# Altium project robotcar.PrjPcb
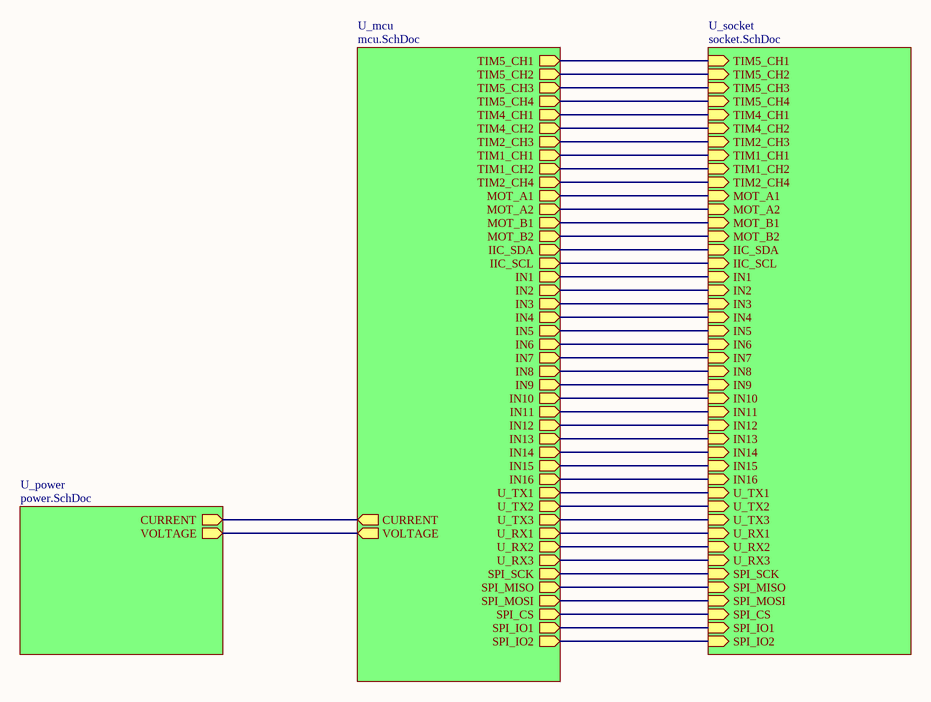
[diagram p0: robotcar.SchDoc]
4 sheets, 123 parts. Net scope: hierarchical (ports join the sheet entries above them; power ports are global).
Board file: robotcar.PcbDoc
Sheets:
  robotcar.SchDoc
    U_socket = socket.SchDoc
    U_mcu = mcu.SchDoc
    U_power = power.SchDoc

## Sheet robotcar.SchDoc
size A3

### Sub-sheets
U_mcu = mcu.SchDoc: TIM5_CH1 (out), TIM5_CH2 (out), TIM5_CH3 (out), TIM5_CH4 (out), TIM4_CH1 (out), TIM4_CH2 (out), TIM2_CH3 (out), TIM1_CH1 (out), TIM1_CH2 (out), TIM2_CH4 (out), MOT_A1 (out), MOT_A2 (out), MOT_B1 (out), MOT_B2 (out), IIC_SDA (out), IIC_SCL (out), IN1 (out), IN2 (out), IN3 (out), IN4 (out), IN5 (out), IN6 (out), IN7 (out), IN8 (out), IN9 (out), IN10 (out), IN11 (out), IN12 (out), IN13 (out), IN14 (out), IN15 (out), IN16 (out), U_TX1 (out), U_TX2 (out), U_TX3 (out), U_RX1 (out), U_RX2 (out), U_RX3 (out), CURRENT (out), VOLTAGE (out), SPI_SCK (out), SPI_MISO (out), SPI_MOSI (out), SPI_CS (out), SPI_IO1 (out), SPI_IO2 (out)
U_power = power.SchDoc: CURRENT (out), VOLTAGE (out)
U_socket = socket.SchDoc: TIM5_CH1 (in), TIM5_CH2 (in), TIM5_CH3 (in), TIM5_CH4 (in), TIM4_CH1 (in), TIM4_CH2 (in), TIM2_CH3 (in), TIM1_CH1 (in), TIM1_CH2 (in), TIM2_CH4 (in), MOT_A1 (in), MOT_A2 (in), MOT_B1 (in), MOT_B2 (in), IIC_SDA (in), IIC_SCL (in), IN1 (in), IN2 (in), IN3 (in), IN4 (in), IN5 (in), IN6 (in), IN7 (in), IN8 (in), IN9 (in), IN10 (in), IN11 (in), IN12 (in), IN13 (in), IN14 (in), IN15 (in), IN16 (in), U_TX1 (in), U_TX2 (in), U_TX3 (in), U_RX1 (in), U_RX2 (in), U_RX3 (in), SPI_SCK (in), SPI_MISO (in), SPI_MOSI (in), SPI_CS (in), SPI_IO1 (in), SPI_IO2 (in)

### Nets
MPU_SCL: sheet U_socket/IIC_SCL, sheet U_mcu/IIC_SCL
MPU_SDA: sheet U_socket/IIC_SDA, sheet U_mcu/IIC_SDA
PA0: sheet U_socket/TIM5_CH1, sheet U_mcu/TIM5_CH1
PA1: sheet U_socket/TIM5_CH2, sheet U_mcu/TIM5_CH2
PA2: sheet U_socket/TIM5_CH3, sheet U_mcu/TIM5_CH3
PA3: sheet U_socket/TIM5_CH4, sheet U_mcu/TIM5_CH4
PA4: sheet U_socket/SPI_CS, sheet U_mcu/SPI_CS
PA5: sheet U_socket/SPI_SCK, sheet U_mcu/SPI_SCK
PA6: sheet U_socket/SPI_MISO, sheet U_mcu/SPI_MISO
PA7: sheet U_socket/SPI_MOSI, sheet U_mcu/SPI_MOSI
PA8: sheet U_socket/IN16, sheet U_mcu/IN16
PA9: sheet U_socket/U_TX1, sheet U_mcu/U_TX1
PA10: sheet U_socket/U_RX1, sheet U_mcu/U_RX1
PA15: sheet U_socket/IN15, sheet U_mcu/IN15
PB0: sheet U_mcu/CURRENT, sheet U_power/CURRENT
PB1: sheet U_mcu/VOLTAGE, sheet U_power/VOLTAGE
PB8: sheet U_socket/IN7, sheet U_mcu/IN7
PB9: sheet U_socket/IN8, sheet U_mcu/IN8
PB10: sheet U_socket/TIM2_CH3, sheet U_mcu/TIM2_CH3
PB11: sheet U_socket/TIM2_CH4, sheet U_mcu/TIM2_CH4
PC0: sheet U_socket/IN1, sheet U_mcu/IN1
PC1: sheet U_socket/IN2, sheet U_mcu/IN2
PC2: sheet U_socket/IN3, sheet U_mcu/IN3
PC3: sheet U_socket/IN4, sheet U_mcu/IN4
PC4: sheet U_socket/IN5, sheet U_mcu/IN5
PC5: sheet U_socket/IN6, sheet U_mcu/IN6
PC6: sheet U_socket/SPI_IO1, sheet U_mcu/SPI_IO1
PC7: sheet U_socket/SPI_IO2, sheet U_mcu/SPI_IO2
PD0: sheet U_socket/IN14, sheet U_mcu/IN14
PD5: sheet U_socket/U_TX2, sheet U_mcu/U_TX2
PD6: sheet U_socket/U_RX2, sheet U_mcu/U_RX2
PD8: sheet U_socket/U_TX3, sheet U_mcu/U_TX3
PD9: sheet U_socket/U_RX3, sheet U_mcu/U_RX3
PD10: sheet U_socket/IN10, sheet U_mcu/IN10
PD11: sheet U_socket/IN11, sheet U_mcu/IN11
PD12: sheet U_socket/TIM4_CH1, sheet U_mcu/TIM4_CH1
PD13: sheet U_socket/TIM4_CH2, sheet U_mcu/TIM4_CH2
PD14: sheet U_socket/IN12, sheet U_mcu/IN12
PD15: sheet U_socket/IN13, sheet U_mcu/IN13
PE9: sheet U_socket/TIM1_CH1, sheet U_mcu/TIM1_CH1
PE10: sheet U_socket/MOT_A1, sheet U_mcu/MOT_A1
PE11: sheet U_socket/TIM1_CH2, sheet U_mcu/TIM1_CH2
PE12: sheet U_socket/MOT_A2, sheet U_mcu/MOT_A2
PE13: sheet U_socket/MOT_B1, sheet U_mcu/MOT_B1
PE14: sheet U_socket/MOT_B2, sheet U_mcu/MOT_B2
PE15: sheet U_socket/IN9, sheet U_mcu/IN9

## Sheet socket.SchDoc
size A4
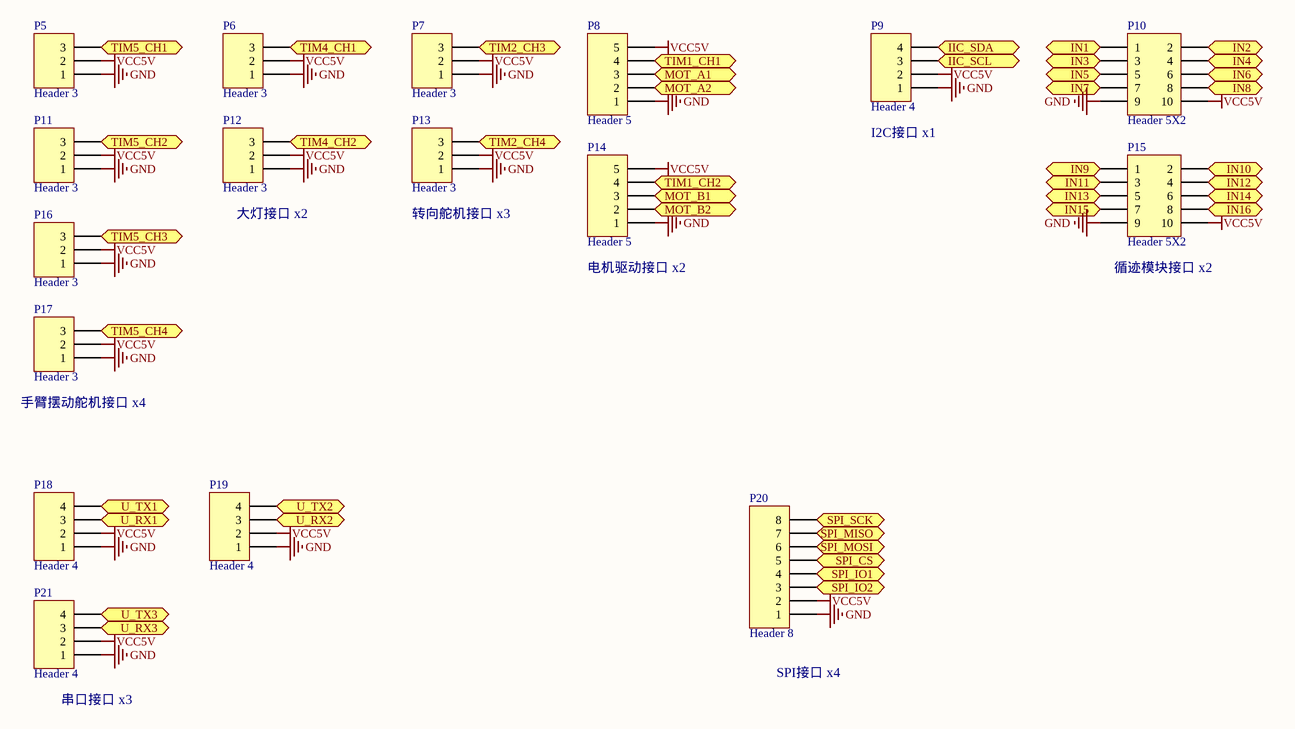
[diagram p1: socket.SchDoc]

### Parts
P5  Header 3  [HDR1X3]
P6  Header 3  [HDR1X3]
P7  Header 3  [HDR1X3]
P8  Header 5  [HDR1X5]
P9  Header 4  [HDR1X4]
P10  Header 5X2  [HDR2X5]
P11  Header 3  [HDR1X3]
P12  Header 3  [HDR1X3]
P13  Header 3  [HDR1X3]
P14  Header 5  [HDR1X5]
P15  Header 5X2  [HDR2X5]
P16  Header 3  [HDR1X3]
P17  Header 3  [HDR1X3]
P18  Header 4  [HDR1X4]
P19  Header 4  [HDR1X4]
P20  Header 8  [HDR1X8]
P21  Header 4  [HDR1X4]

### Ports
IIC_SCL (in), IIC_SDA (in), IN1 (in), IN2 (in), IN3 (in), IN4 (in), IN5 (in), IN6 (in), IN7 (in), IN8 (in), IN9 (in), IN10 (in), IN11 (in), IN12 (in), IN13 (in), IN14 (in), IN15 (in), IN16 (in), MOT_A1 (in), MOT_A2 (in), MOT_B1 (in), MOT_B2 (in), SPI_CS (in), SPI_IO1 (in), SPI_IO2 (in), SPI_MISO (in), SPI_MOSI (in), SPI_SCK (in), TIM1_CH1 (in), TIM1_CH2 (in), TIM2_CH3 (in), TIM2_CH4 (in), TIM4_CH1 (in), TIM4_CH2 (in), TIM5_CH1 (in), TIM5_CH2 (in), TIM5_CH3 (in), TIM5_CH4 (in), U_RX1 (in), U_RX2 (in), U_RX3 (in), U_TX1 (in), U_TX2 (in), U_TX3 (in)

### Nets
GND: P5.1 P6.1 P7.1 P8.1 P9.1 P10.9 P11.1 P12.1 P13.1 P14.1 P15.9 P16.1 P17.1 P18.1 P19.1 P20.1 P21.1
VCC5V: P5.2 P6.2 P7.2 P8.5 P9.2 P10.10 P11.2 P12.2 P13.2 P14.5 P15.10 P16.2 P17.2 P18.2 P19.2 P20.2 P21.2
MPU_SCL: P9.3 ; port IIC_SCL
MPU_SDA: P9.4 ; port IIC_SDA
PA0: P5.3 ; port TIM5_CH1
PA1: P11.3 ; port TIM5_CH2
PA2: P16.3 ; port TIM5_CH3
PA3: P17.3 ; port TIM5_CH4
PA4: P20.5 ; port SPI_CS
PA5: P20.8 ; port SPI_SCK
PA6: P20.7 ; port SPI_MISO
PA7: P20.6 ; port SPI_MOSI
PA8: P15.8 ; port IN16
PA9: P18.4 ; port U_TX1
PA10: P18.3 ; port U_RX1
PA15: P15.7 ; port IN15
PB8: P10.7 ; port IN7
PB9: P10.8 ; port IN8
PB10: P7.3 ; port TIM2_CH3
PB11: P13.3 ; port TIM2_CH4
PC0: P10.1 ; port IN1
PC1: P10.2 ; port IN2
PC2: P10.3 ; port IN3
PC3: P10.4 ; port IN4
PC4: P10.5 ; port IN5
PC5: P10.6 ; port IN6
PC6: P20.4 ; port SPI_IO1
PC7: P20.3 ; port SPI_IO2
PD0: P15.6 ; port IN14
PD5: P19.4 ; port U_TX2
PD6: P19.3 ; port U_RX2
PD8: P21.4 ; port U_TX3
PD9: P21.3 ; port U_RX3
PD10: P15.2 ; port IN10
PD11: P15.3 ; port IN11
PD12: P6.3 ; port TIM4_CH1
PD13: P12.3 ; port TIM4_CH2
PD14: P15.4 ; port IN12
PD15: P15.5 ; port IN13
PE9: P8.4 ; port TIM1_CH1
PE10: P8.3 ; port MOT_A1
PE11: P14.4 ; port TIM1_CH2
PE12: P8.2 ; port MOT_A2
PE13: P14.3 ; port MOT_B1
PE14: P14.2 ; port MOT_B2
PE15: P15.1 ; port IN9

### Notes on the sheet
- (near P9) I2C接口 x1
- (near P12) 大灯接口 x2
- (near P13) 转向舵机接口 x3
- (near P14) 电机驱动接口 x2
- (near P15) 循迹模块接口 x2
- (near P17) 手臂摆动舵机接口 x4
- (near P20) SPI接口 x4
- (near P21) 串口接口 x3
- Title
- Size:
- Date:
- A4
- Number:
- Time:
- Revision:
- Sheet
- of
- File:

### Library data of the parts
P5-P7 P11-P13 P16 P17 = Header 3: Header, 3-Pin; LatestRevisionDate: 17-Jul-2002; LatestRevisionNote: Re-released for DXP Platform.; Publisher: Altium Limited
P8 P14 = Header 5: Header, 5-Pin; LatestRevisionDate: 17-Jul-2002; LatestRevisionNote: Re-released for DXP Platform.; Publisher: Altium Limited
P9 P18 P19 P21 = Header 4: Header, 4-Pin; LatestRevisionDate: 17-Jul-2002; LatestRevisionNote: Re-released for DXP Platform.; Publisher: Altium Limited
P10 P15 = Header 5X2: Header, 5-Pin, Dual row; LatestRevisionDate: 17-Jul-2002; LatestRevisionNote: Re-released for DXP Platform.; Publisher: Altium Limited
P20 = Header 8: Header, 8-Pin; LatestRevisionDate: 17-Jul-2002; LatestRevisionNote: Re-released for DXP Platform.; Publisher: Altium Limited

## Sheet mcu.SchDoc
size A3
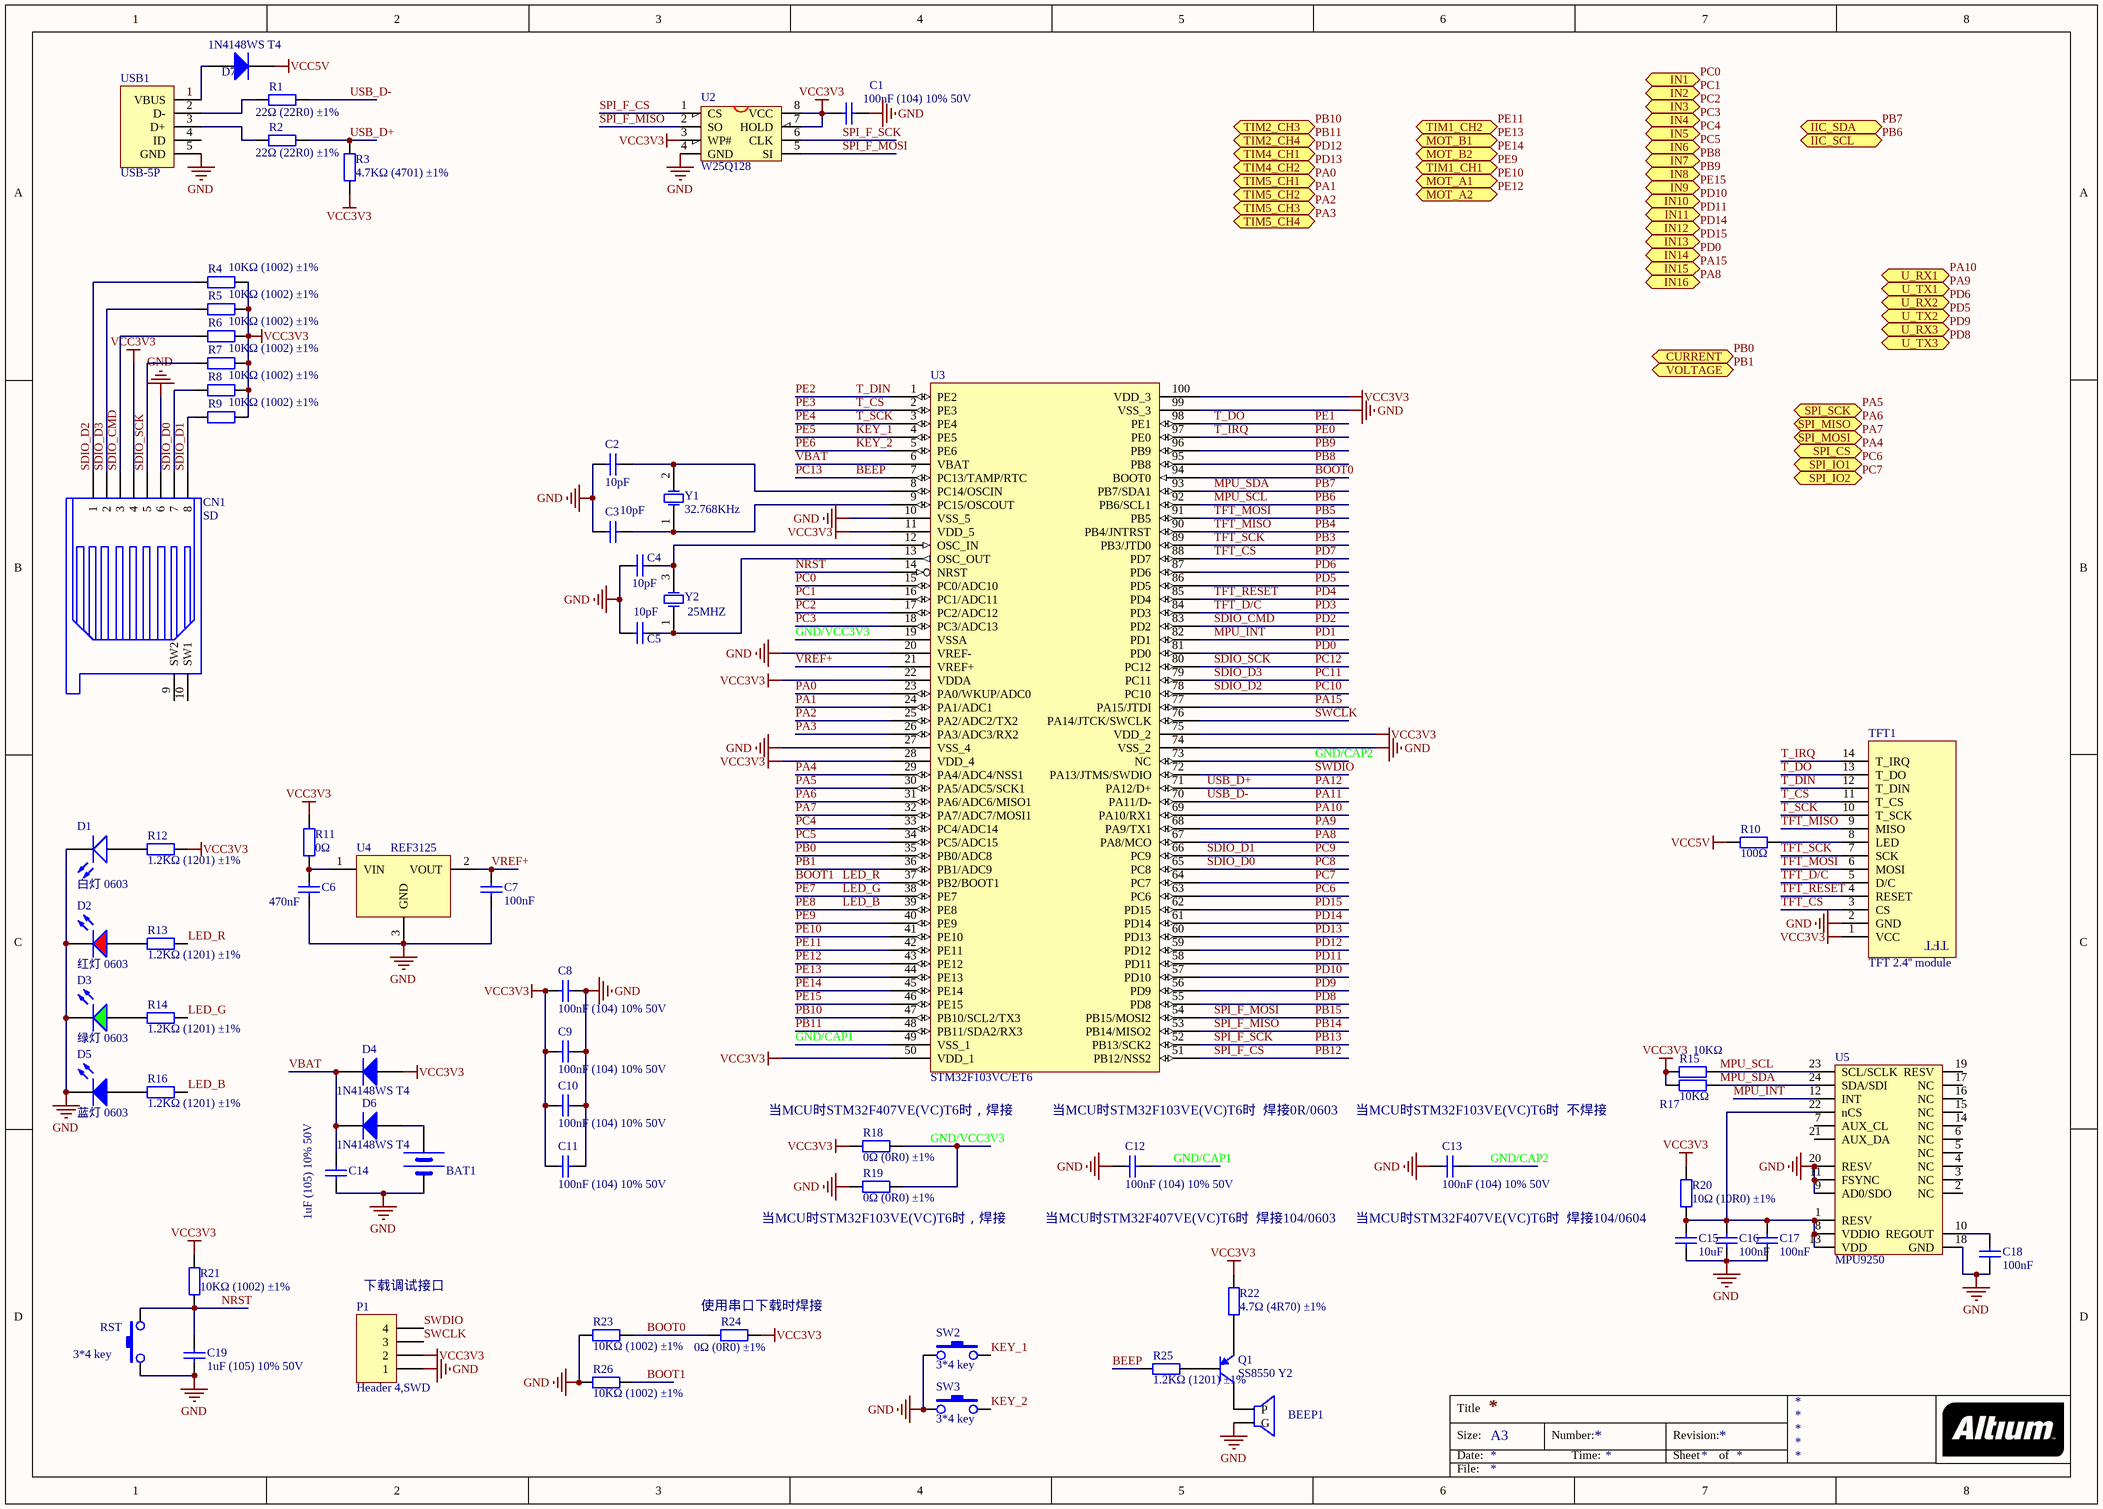
[diagram p2: mcu.SchDoc]

### Parts
BAT1  BATT  [BATM]  (value not drawn)
BEEP1  BEEP  [BELL-5]  (value not drawn)
C1  100nF (104) 10% 50V  [0603_C]
C2  10pF  [0603_C]
C3  10pF  [0603_C]
C4  10pF  [0603_C]
C5  10pF  [0603_C]
C6  470nF  [0603_C]
C7  100nF  [0603_C]
C8  100nF (104) 10% 50V  [0603_C]
C9  100nF (104) 10% 50V  [0603_C]
C10  100nF (104) 10% 50V  [0603_C]
C11  100nF (104) 10% 50V  [0603_C]
C12  100nF (104) 10% 50V  [0603_C]
C13  100nF (104) 10% 50V  [0603_C]
C14  1uF (105) 10% 50V  [0603_C]
C15  10uF  [0603_C]
C16  100nF  [0603_C]
C17  100nF  [0603_C]
C18  100nF  [0603_C]
C19  1uF (105) 10% 50V  [0603_C]
CN1  SD  [TF]
D1  白灯 0603  [0603_LED_S1]
D2  红灯 0603  [0603_LED_S1]
D3  绿灯 0603  [0603_LED_S1]
D4  1N4148WS T4  [SOD-323]
D5  蓝灯 0603  [0603_LED_S1]
D6  1N4148WS T4  [SOD-323]
D7  1N4148WS T4  [SOD-323]
P1  Header 4,SWD  [HDR1X4]
Q1  SS8550 Y2  [SOT-23(SOT-23-3)]
R1  22Ω (22R0) ±1%  [0603_R]
R2  22Ω (22R0) ±1%  [0603_R]
R3  4.7KΩ (4701) ±1%  [0603_R]
R4  10KΩ (1002) ±1%  [0603_R]
R5  10KΩ (1002) ±1%  [0603_R]
R6  10KΩ (1002) ±1%  [0603_R]
R7  10KΩ (1002) ±1%  [0603_R]
R8  10KΩ (1002) ±1%  [0603_R]
R9  10KΩ (1002) ±1%  [0603_R]
R10  100Ω  [0603_R]
R11  0Ω  [0603_R]
R12  1.2KΩ (1201) ±1%  [0603_R]
R13  1.2KΩ (1201) ±1%  [0603_R]
R14  1.2KΩ (1201) ±1%  [0603_R]
R15  10KΩ  [0603_R]
R16  1.2KΩ (1201) ±1%  [0603_R]
R17  10KΩ  [0603_R]
R18  0Ω (0R0) ±1%  [0603_R]
R19  0Ω (0R0) ±1%  [0603_R]
R20  10Ω (10R0) ±1%  [0603_R]
R21  10KΩ (1002) ±1%  [0603_R]
R22  4.7Ω (4R70) ±1%  [0603_R]
R23  10KΩ (1002) ±1%  [0603_R]
R24  0Ω (0R0) ±1%  [0603_R]
R25  1.2KΩ (1201) ±1%  [0603_R]
R26  10KΩ (1002) ±1%  [0603_R]
RST  3*4 key  [KEY-SMT]
SW2  3*4 key  [KEY-SMT]
SW3  3*4 key  [KEY-SMT]
TFT1  TFT 2.4'' module  [TFT 2.4'' module]
U2  W25Q128  [SOIC-8]
U3  STM32F103VC/ET6  [LQFP-100]
U4  REF3125  [SOT-23(SOT-23-3)]
U5  MPU9250  [QFN24-t]
USB1  USB-5P  [USB-MICRO_B]
Y1  32.768KHz  [MC-306]
Y2  25MHZ  [SMD-3225_4P]

### Ports
CURRENT (out), IIC_SCL (out), IIC_SDA (out), IN1 (out), IN2 (out), IN3 (out), IN4 (out), IN5 (out), IN6 (out), IN7 (out), IN8 (out), IN9 (out), IN10 (out), IN11 (out), IN12 (out), IN13 (out), IN14 (out), IN15 (out), IN16 (out), MOT_A1 (out), MOT_A2 (out), MOT_B1 (out), MOT_B2 (out), SPI_CS (out), SPI_IO1 (out), SPI_IO2 (out), SPI_MISO (out), SPI_MOSI (out), SPI_SCK (out), TIM1_CH1 (out), TIM1_CH2 (out), TIM2_CH3 (out), TIM2_CH4 (out), TIM4_CH1 (out), TIM4_CH2 (out), TIM5_CH1 (out), TIM5_CH2 (out), TIM5_CH3 (out), TIM5_CH4 (out), U_RX1 (out), U_RX2 (out), U_RX3 (out), U_TX1 (out), U_TX2 (out), U_TX3 (out), VOLTAGE (out)

### Nets
GND: BAT1.2(GND) BEEP1.2(G) C1.2 C2.1 C3.1 C4.1 C5.1 C6.1 C7.1 C8.2 C9.2 C10.2 C11.2 C12.1 C13.1 C14.1 C15.1 C16.1 C17.1 C18.1 C19.1 CN1.6 D1.K D2.K D3.K D5.K P1.1 R19.1 R23.2 R26.2 RST.1 SW2.1 SW3.1 TFT1.2(GND) U2.4(GND) U3.10(VSS_5) U3.20(VREF-) U3.27(VSS_4) U3.74(VSS_2) U3.99(VSS_3) U4.3(GND) U5.9(AD0/SDO) U5.11(FSYNC) U5.18(GND) U5.20(RESV) USB1.5(GND)
VCC3V3: C1.1 C8.1 C9.1 C10.1 C11.1 CN1.4 D4.1(A) P1.2 R3.1 R4.1 R5.1 R6.1 R7.1 R8.1 R9.1 R11.1 R12.2 R15.1 R17.1 R18.1 R20.2 R21.2 R22.2 R24.2 TFT1.1(VCC) U2.3(WP#) U2.7(HOLD) U2.8(VCC) U3.11(VDD_5) U3.22(VDDA) U3.28(VDD_4) U3.50(VDD_1) U3.75(VDD_2) U3.100(VDD_3)
VCC5V: D7.2(K) R10.1
BEEP: R25.1 U3.7(PC13/TAMP/RTC)  [also labelled PC13]
BOOT0: R23.1 R24.1 U3.94(BOOT0)
BOOT1: R13.2 R26.1 U3.37(PB2/BOOT1)  [also labelled LED_R]
GND/CAP1: C12.2 U3.49(VSS_1)
GND/CAP2: C13.2 U3.73(NC)
GND/VCC3V3: R18.2 R19.2 U3.19(VSSA)
KEY_1: SW2.2 U3.4(PE5)  [also labelled PE5]
KEY_2: SW3.2 U3.5(PE6)  [also labelled PE6]
LED_B: R16.2 U3.39(PE8)  [also labelled PE8]
LED_G: R14.2 U3.38(PE7)  [also labelled PE7]
MPU_INT: U3.82(PD1) U5.12(INT)  [also labelled PD1]
MPU_SCL: R15.2 U3.92(PB6/SCL1) U5.23(SCL/SCLK) ; port IIC_SCL  [also labelled PB6]
MPU_SDA: R17.2 U3.93(PB7/SDA1) U5.24(SDA/SDI) ; port IIC_SDA  [also labelled PB7]
NRST: C19.2 R21.1 RST.2 U3.14(NRST)
PA0: U3.23(PA0/WKUP/ADC0) ; port TIM5_CH1
PA1: U3.24(PA1/ADC1) ; port TIM5_CH2
PA2: U3.25(PA2/ADC2/TX2) ; port TIM5_CH3
PA3: U3.26(PA3/ADC3/RX2) ; port TIM5_CH4
PA4: U3.29(PA4/ADC4/NSS1) ; port SPI_CS
PA5: U3.30(PA5/ADC5/SCK1) ; port SPI_SCK
PA6: U3.31(PA6/ADC6/MISO1) ; port SPI_MISO
PA7: U3.32(PA7/ADC7/MOSI1) ; port SPI_MOSI
PA8: U3.67(PA8/MCO) ; port IN16
PA9: U3.68(PA9/TX1) ; port U_TX1
PA10: U3.69(PA10/RX1) ; port U_RX1
PA11: R1.2 U3.70(PA11/D-)  [also labelled USB_D-]
PA12: R2.2 R3.2 U3.71(PA12/D+)  [also labelled USB_D+]
PA15: U3.77(PA15/JTDI) ; port IN15
PB0: U3.35(PB0/ADC8) ; port CURRENT
PB1: U3.36(PB1/ADC9) ; port VOLTAGE
PB3: TFT1.7(SCK) U3.89(PB3/JTD0)  [also labelled TFT_SCK]
PB4: TFT1.9(MISO) U3.90(PB4/JNTRST)  [also labelled TFT_MISO]
PB5: TFT1.6(MOSI) U3.91(PB5)  [also labelled TFT_MOSI]
PB8: U3.95(PB8) ; port IN7
PB9: U3.96(PB9) ; port IN8
PB10: U3.47(PB10/SCL2/TX3) ; port TIM2_CH3
PB11: U3.48(PB11/SDA2/RX3) ; port TIM2_CH4
PB12: U2.1(CS) U3.51(PB12/NSS2)  [also labelled SPI_F_CS]
PB13: U2.6(CLK) U3.52(PB13/SCK2)  [also labelled SPI_F_SCK]
PB14: U2.2(SO) U3.53(PB14/MISO2)  [also labelled SPI_F_MISO]
PB15: U2.5(SI) U3.54(PB15/MOSI2)  [also labelled SPI_F_MOSI]
PC0: U3.15(PC0/ADC10) ; port IN1
PC1: U3.16(PC1/ADC11) ; port IN2
PC2: U3.17(PC2/ADC12) ; port IN3
PC3: U3.18(PC3/ADC13) ; port IN4
PC4: U3.33(PC4/ADC14) ; port IN5
PC5: U3.34(PC5/ADC15) ; port IN6
PC6: U3.63(PC6) ; port SPI_IO1
PC7: U3.64(PC7) ; port SPI_IO2
PC8: CN1.7 R8.2 U3.65(PC8)  [also labelled SDIO_D0]
PC9: CN1.8 R9.2 U3.66(PC9)  [also labelled SDIO_D1]
PC10: CN1.1 R4.2 U3.78(PC10)  [also labelled SDIO_D2]
PC11: CN1.2 R5.2 U3.79(PC11)  [also labelled SDIO_D3]
PC12: CN1.5 R7.2 U3.80(PC12)  [also labelled SDIO_SCK]
PD0: U3.81(PD0) ; port IN14
PD2: CN1.3 R6.2 U3.83(PD2)  [also labelled SDIO_CMD]
PD3: TFT1.5(D/C) U3.84(PD3)  [also labelled TFT_D/C]
PD4: TFT1.4(RESET) U3.85(PD4)  [also labelled TFT_RESET]
PD5: U3.86(PD5) ; port U_TX2
PD6: U3.87(PD6) ; port U_RX2
PD7: TFT1.3(CS) U3.88(PD7)  [also labelled TFT_CS]
PD8: U3.55(PD8) ; port U_TX3
PD9: U3.56(PD9) ; port U_RX3
PD10: U3.57(PD10) ; port IN10
PD11: U3.58(PD11) ; port IN11
PD12: U3.59(PD12) ; port TIM4_CH1
PD13: U3.60(PD13) ; port TIM4_CH2
PD14: U3.61(PD14) ; port IN12
PD15: U3.62(PD15) ; port IN13
PE0: TFT1.14(T_IRQ) U3.97(PE0)  [also labelled T_IRQ]
PE1: TFT1.13(T_DO) U3.98(PE1)  [also labelled T_DO]
PE2: TFT1.12(T_DIN) U3.1(PE2)  [also labelled T_DIN]
PE3: TFT1.11(T_CS) U3.2(PE3)  [also labelled T_CS]
PE4: TFT1.10(T_SCK) U3.3(PE4)  [also labelled T_SCK]
PE9: U3.40(PE9) ; port TIM1_CH1
PE10: U3.41(PE10) ; port MOT_A1
PE11: U3.42(PE11) ; port TIM1_CH2
PE12: U3.43(PE12) ; port MOT_A2
PE13: U3.44(PE13) ; port MOT_B1
PE14: U3.45(PE14) ; port MOT_B2
PE15: U3.46(PE15) ; port IN9
SWCLK: P1.3 U3.76(PA14/JTCK/SWCLK)
SWDIO: P1.4 U3.72(PA13/JTMS/SWDIO)
VBAT: C14.2 D4.2(K) D6.2(K) U3.6(VBAT)
VREF+: C7.2 U3.21(VREF+) U4.2(VOUT)
NetBAT1_1: BAT1.1(VCC) D6.1(A)
NetBEEP1_1: BEEP1.1(P) Q1.3(C)
NetC2_2: C2.2 U3.8(PC14/OSCIN) Y1.2(OSC2)
NetC3_2: C3.2 U3.9(PC15/OSCOUT) Y1.1(OSC1)
NetC4_2: C4.2 U3.12(OSC_IN) Y2.3(OSC2)
NetC5_2: C5.2 U3.13(OSC_OUT) Y2.1(OSC1)
NetC6_2: C6.2 R11.2 U4.1(VIN)
NetC15_2: C15.2 C16.2 C17.2 R20.1 U5.1(RESV) U5.8(VDDIO) U5.13(VDD) U5.22(nCS)
NetC18_2: C18.2 U5.10(REGOUT)
NetD1_A: D1.A R12.1
NetD2_A: D2.A R13.1
NetD3_A: D3.A R14.1
NetD5_A: D5.A R16.1
NetD7_1: D7.1(A) USB1.1(VBUS)
NetQ1_1: Q1.1(B) R25.2
NetQ1_2: Q1.2(E) R22.1
NetR1_1: R1.1 USB1.2(D-)
NetR2_1: R2.1 USB1.3(D+)
NetR10_2: R10.2 TFT1.8(LED)

Not connected (* = marked no-connect by the designer): CN1 9(SW2) 10(SW1); U5 2(NC) 3(NC) 4(NC) 5(NC) 6(NC) 7(AUX_CL) 14(NC) 15(NC) 16(NC) 17(NC) 19(RESV) 21(AUX_DA); USB1 4(ID)

### Notes on the sheet
- (near R18) 当MCU时STM32F407VE(VC)T6时，焊接
- 当MCU时STM32F103VE(VC)T6时  焊接0R/0603
- (near C13) 当MCU时STM32F103VE(VC)T6时  不焊接
- (near R19) 当MCU时STM32F103VE(VC)T6时，焊接
- 当MCU时STM32F407VE(VC)T6时  焊接104/0603
- (near C13) 当MCU时STM32F407VE(VC)T6时  焊接104/0604
- (near P1) 下载调试接口
- (near R24) 使用串口下载时焊接
- Title
- Size:
- Date:
- A3
- Number:
- Time:
- Revision:
- Sheet
- of
- File:
- (in symbol TFT 2.4'' module) TFT

### Library data of the parts
BAT1 = BAT
C1 C7-C13 C16-C18 = 0603 100nF (104) 10% 50V: 贴片电容; ComponentLink1Description: 供应商链接; ComponentLink1URL: http://www.szlcsc.com/product/details_15331.html; Package: 0603; Supplier: LC; SuppliersPartNumber: C14663
C2-C5 = 0603 10pF (100) 5% 50V: 贴片电容; ComponentLink1Description: 供应商链接; ComponentLink1URL: http://www.szlcsc.com/product/details_1986.html; Package: 0603; Supplier: LC; SuppliersPartNumber: C1634
C6 = 0603 470nF (474) 10% 25V: 贴片电容; ComponentLink1Description: 供应商链接; ComponentLink1URL: http://www.szlcsc.com/product/details_1975.html; Package: 0603; Supplier: LC; SuppliersPartNumber: C1623
C14 C19 = 0603 1uF (105) 10% 50V: 贴片电容; ComponentLink1Description: 供应商链接; ComponentLink1URL: http://www.szlcsc.com/product/details_16531.html; Package: 0603; Supplier: LC; SuppliersPartNumber: C15849
C15 = 0603 10uF (106) 10% 10V: 贴片电容; ComponentLink1Description: 供应商链接; ComponentLink1URL: http://www.szlcsc.com/product/details_20411.html; Package: 0603; Supplier: LC; SuppliersPartNumber: C19702
CN1 = SMS016AFA5E
D1 = 0603 白灯: 发光二极管; ComponentLink1Description: 供应商链接; ComponentLink1URL: http://www.szlcsc.com/product/details_2663.html; Package: 0603; Supplier: LC; SuppliersPartNumber: C2290
D2 = 0603 红灯: 发光二极管; ComponentLink1Description: 供应商链接; ComponentLink1URL: http://www.szlcsc.com/product/details_2659.html; Package: 0603; Supplier: LC; SuppliersPartNumber: C2286
D3 = 0603 绿灯: 发光二极管; ComponentLink1Description: 供应商链接; ComponentLink1URL: http://www.szlcsc.com/product/details_73152.html; Package: 0603; Supplier: LC; SuppliersPartNumber: C72043
D4 D6 D7 = SOD-323 1N4148WS T4: 二极管; ComponentLink1Description: 供应商链接; ComponentLink1URL: http://www.szlcsc.com/product/details_2485.html; Package: SOD-323; Supplier: LC; SuppliersPartNumber: C2128
D5 = 0603 蓝灯: 发光二极管; ComponentLink1Description: 供应商链接; ComponentLink1URL: http://www.szlcsc.com/product/details_73150.html; Package: 0603; Supplier: LC; SuppliersPartNumber: C72041
P1 = Header 4: Header, 4-Pin; LatestRevisionDate: 17-Jul-2002; LatestRevisionNote: Re-released for DXP Platform.; Publisher: Altium Limited
Q1 = SOT-23 SS8550 Y2: 三极管; ComponentLink1Description: 供应商链接; ComponentLink1URL: http://www.szlcsc.com/product/details_9037.html; Package: SOT-23; Supplier: LC; SuppliersPartNumber: C8542
R1 R2 = 0603 22Ω (22R0) 1%: 贴片电阻; ComponentLink1Description: 供应商链接; ComponentLink1URL: http://www.szlcsc.com/product/details_24078.html; Package: 0603; Supplier: LC; SuppliersPartNumber: C23345
R3 = 0603 4.7KΩ (4701) 1%: 贴片电阻; ComponentLink1Description: 供应商链接; ComponentLink1URL: http://www.szlcsc.com/product/details_23889.html; Package: 0603; Supplier: LC; SuppliersPartNumber: C23162
R4-R9 R15 R17 R21 R23 R26 = 0603 10KΩ (1002) 1%: 贴片电阻; ComponentLink1Description: 供应商链接; ComponentLink1URL: http://www.szlcsc.com/product/details_26547.html; Package: 0603; Supplier: LC; SuppliersPartNumber: C25804
R10 = 0603 100Ω (1000) 1%: 贴片电阻; ComponentLink1Description: 供应商链接; ComponentLink1URL: http://www.szlcsc.com/product/details_23502.html; Package: 0603; Supplier: LC; SuppliersPartNumber: C22775
R11 R18 R19 R24 = 0603 0Ω (0R0) 1%: 贴片电阻; ComponentLink1Description: 供应商链接; ComponentLink1URL: http://www.szlcsc.com/product/details_21903.html; Package: 0603; Supplier: LC; SuppliersPartNumber: C21189
R12-R14 R16 R25 = 0603 1.2KΩ (1201) 1%: 贴片电阻; ComponentLink1Description: 供应商链接; ComponentLink1URL: http://www.szlcsc.com/product/details_23492.html; Package: 0603; Supplier: LC; SuppliersPartNumber: C22765
R20 = 0603 10Ω (10R0) 1%: 贴片电阻; ComponentLink1Description: 供应商链接; ComponentLink1URL: http://www.szlcsc.com/product/details_23586.html; Package: 0603; Supplier: LC; SuppliersPartNumber: C22859
R22 = 0603 4.7Ω (4R70) 1%: 贴片电阻; ComponentLink1Description: 供应商链接; ComponentLink1URL: http://www.szlcsc.com/product/details_23891.html; Package: 0603; Supplier: LC; SuppliersPartNumber: C23164
RST SW2 SW3 = SW-PB_V: SWITCH
U2 = W25X16: W25X16;SST25VF016;MX25L1605
U3 = STM32F103VBH6
U4 = REF3125: 电压基准芯片
U5 = MPU9250: 9轴运动处理传感器
USB1 = USB-5P: 微型USB母座; 版权归属: 源创客; BOM名称: 微型USB母座; 学习资源: www.ooocke.com
Y1 = XTAL: Crystal Oscillator; Published: 8-Jun-2000; LatestRevisionDate: 17-Jul-2002; LatestRevisionNote: Re-released for DXP Platform.; Publisher: Altium Limited
Y2 = SMD-3225_4P  25MHZ 12PF 10PPM: 贴片晶振; ComponentLink1Description: 供应商链接; ComponentLink1URL: http://www.szlcsc.com/product/details_9526.html; Package: SMD-3225_4P; Supplier: LC; SuppliersPartNumber: C9006

## Sheet power.SchDoc
size A4
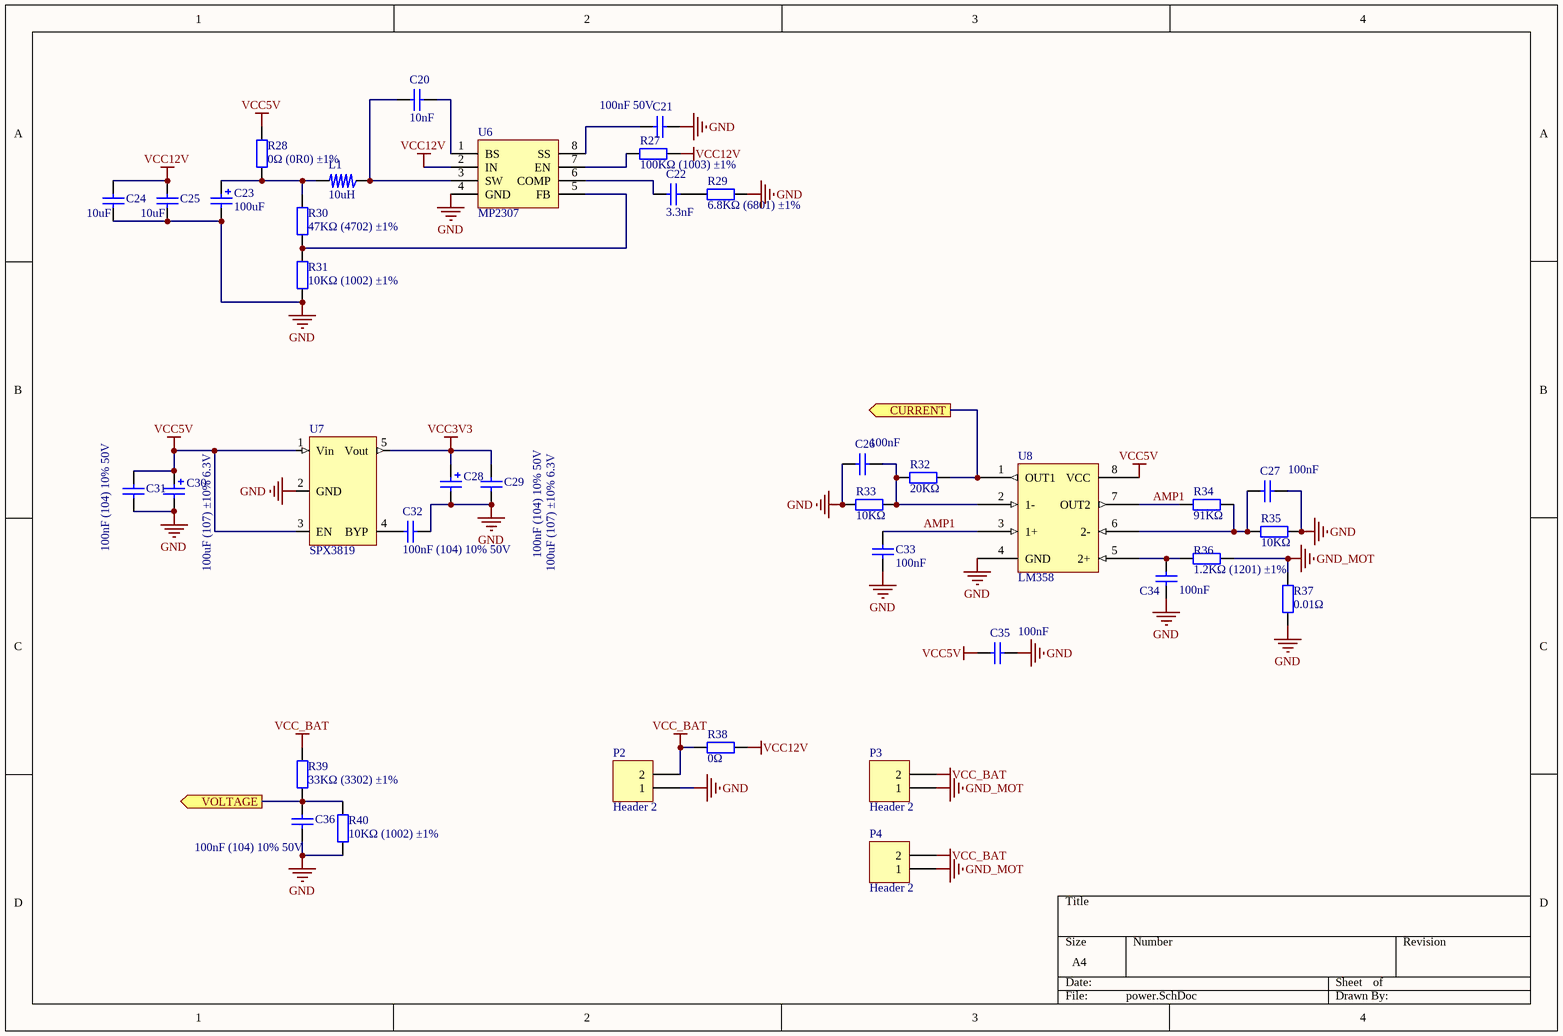
[diagram p3: power.SchDoc]

### Parts
C20  10nF  [0603_C]
C21  100nF 50V  [0603_C]
C22  3.3nF  [0603_C]
C23  100uF  [CASE-B_3528]
C24  10uF  [1206_C]
C25  10uF  [1206_C]
C26  100nF  [0603_C]
C27  100nF  [0603_C]
C28  100uF (107) ±10% 6.3V  [CASE-B_3528]
C29  100nF (104) 10% 50V  [0603_C]
C30  100uF (107) ±10% 6.3V  [CASE-B_3528]
C31  100nF (104) 10% 50V  [0603_C]
C32  100nF (104) 10% 50V  [0603_C]
C33  100nF  [0603_C]
C34  100nF  [0603_C]
C35  100nF  [0603_C]
C36  100nF (104) 10% 50V  [0603_C]
L1  10uH  [L_SOP74]
P2  Header 2  [HT508R]
P3  Header 2  [HT508R]
P4  Header 2  [HT508R]
R27  100KΩ (1003) ±1%  [0603_R]
R28  0Ω (0R0) ±1%  [0603_R]
R29  6.8KΩ (6801) ±1%  [0603_R]
R30  47KΩ (4702) ±1%  [0603_R]
R31  10KΩ (1002) ±1%  [0603_R]
R32  20KΩ  [0603_R]
R33  10KΩ  [0603_R]
R34  91KΩ  [0603_R]
R35  10KΩ  [0603_R]
R36  1.2KΩ (1201) ±1%  [0603_R]
R37  0.01Ω  [2512_R]
R38  0Ω  [1206_R]
R39  33KΩ (3302) ±1%  [0603_R]
R40  10KΩ (1002) ±1%  [0603_R]
U6  MP2307  [SOIC-8_EP_150mil]
U7  SPX3819  [SOT25-5]
U8  LM358  [SOIC-8_150mil]

### Ports
CURRENT (out), VOLTAGE (out)

### Nets
GND: C21.1 C23.2 C24.1 C25.1 C26.1 C27.2 C28.2 C29.1 C30.2 C31.2 C32.1 C33.1 C34.1 C35.2 C36.2 P2.1 R29.2 R31.1 R33.2 R35.1 R37.2 R40.1 U6.4(GND) U7.2(GND) U8.4(GND)
GND_MOT: P3.1 P4.1 R36.2 R37.1
VCC3V3: C28.1 C29.2 U7.5(Vout)
VCC5V: C30.1 C31.1 C35.1 R28.2 U7.1(Vin) U7.3(EN) U8.8(VCC)
VCC12V: C24.2 C25.2 R27.2 R38.1 U6.2(IN)
VCC_BAT: P2.2 P3.2 P4.2 R38.2 R39.2
AMP1: C33.2 R34.1 U8.3(1+) U8.7(OUT2)
PB0: R32.2 U8.1(OUT1) ; port CURRENT
PB1: C36.1 R39.1 R40.2 ; port VOLTAGE
NetC20_1: C20.1 U6.1(BS)
NetC20_2: C20.2 L1.1 U6.3(SW)
NetC21_2: C21.2 U6.8(SS)
NetC22_1: C22.1 U6.6(COMP)
NetC22_2: C22.2 R29.1
NetC23_1: C23.1 L1.2 R28.1 R30.2
NetC26_2: C26.2 R32.1 R33.1 U8.2(1-)
NetC27_1: C27.1 R34.2 R35.2 U8.6(2-)
NetC32_2: C32.2 U7.4(BYP)
NetC34_2: C34.2 R36.1 U8.5(2+)
NetR27_1: R27.1 U6.7(EN)
NetR30_1: R30.1 R31.2 U6.5(FB)

### Library data of the parts
C20 = 0603 10nF (103) 10% 50V: 贴片电容; ComponentLink1Description: 供应商链接; ComponentLink1URL: http://www.szlcsc.com/product/details_58143.html; Package: 0603; Supplier: LC; SuppliersPartNumber: C57112
C21 C26 C27 C29 C31-C36 = 0603 100nF (104) 10% 50V: 贴片电容; ComponentLink1Description: 供应商链接; ComponentLink1URL: http://www.szlcsc.com/product/details_15331.html; Package: 0603; Supplier: LC; SuppliersPartNumber: C14663
C22 = 0603 3.3nF (332) 10% 50V: 贴片电容; ComponentLink1Description: 供应商链接; ComponentLink1URL: http://www.szlcsc.com/product/details_1965.html; Package: 0603; Supplier: LC; SuppliersPartNumber: C1613
C23 C28 C30 = 3528 100uF (107) 10% 6.3V: 钽电容; ComponentLink1Description: 供应商链接; ComponentLink1URL: http://www.szlcsc.com/product/details_16815.html; Package: 3528; Supplier: LC; SuppliersPartNumber: C16133
C24 C25 = 1206 10uF (106) 10% 50V: 贴片电容; ComponentLink1Description: 供应商链接; ComponentLink1URL: http://www.szlcsc.com/product/details_14236.html; Package: 1206; Supplier: LC; SuppliersPartNumber: C13585
L1 = L_SOP
P2-P4 = Header 2: Header, 2-Pin; LatestRevisionDate: 17-Jul-2002; LatestRevisionNote: Re-released for DXP Platform.; Publisher: Altium Limited
R27 = 0603 100KΩ (1003) 1%: 贴片电阻; ComponentLink1Description: 供应商链接; ComponentLink1URL: http://www.szlcsc.com/product/details_26546.html; Package: 0603; Supplier: LC; SuppliersPartNumber: C25803
R28 = 0603 0Ω (0R0) 1%: 贴片电阻; ComponentLink1Description: 供应商链接; ComponentLink1URL: http://www.szlcsc.com/product/details_21903.html; Package: 0603; Supplier: LC; SuppliersPartNumber: C21189
R29 = 0603 6.8KΩ (6801) 1%: 贴片电阻; ComponentLink1Description: 供应商链接; ComponentLink1URL: http://www.szlcsc.com/product/details_23939.html; Package: 0603; Supplier: LC; SuppliersPartNumber: C23212
R30 = 0603 47KΩ (4702) 1%: 贴片电阻; ComponentLink1Description: 供应商链接; ComponentLink1URL: http://www.szlcsc.com/product/details_26562.html; Package: 0603; Supplier: LC; SuppliersPartNumber: C25819
R31 R33 R35 R40 = 0603 10KΩ (1002) 1%: 贴片电阻; ComponentLink1Description: 供应商链接; ComponentLink1URL: http://www.szlcsc.com/product/details_26547.html; Package: 0603; Supplier: LC; SuppliersPartNumber: C25804
R32 = 0603 20KΩ (2002) 1%: 贴片电阻; ComponentLink1Description: 供应商链接; ComponentLink1URL: http://www.szlcsc.com/product/details_4591.html; Package: 0603; Supplier: LC; SuppliersPartNumber: C4184
R34 = 0603 91KΩ (9102) 1%: 贴片电阻; ComponentLink1Description: 供应商链接; ComponentLink1URL: http://www.szlcsc.com/product/details_23992.html; Package: 0603; Supplier: LC; SuppliersPartNumber: C23265
R36 = 0603 1.2KΩ (1201) 1%: 贴片电阻; ComponentLink1Description: 供应商链接; ComponentLink1URL: http://www.szlcsc.com/product/details_23492.html; Package: 0603; Supplier: LC; SuppliersPartNumber: C22765
R37 = 1206 100Ω (1000) 1%: 贴片电阻; ComponentLink1Description: 供应商链接; ComponentLink1URL: http://www.szlcsc.com/product/details_18589.html; Package: 1206; Supplier: LC; SuppliersPartNumber: C17901
R38 = 1206 100Ω (1000) 1%: 自恢复保险丝; ComponentLink1Description: 供应商链接; ComponentLink1URL: http://www.szlcsc.com/product/details_18589.html; Package: 1206; Supplier: LC; SuppliersPartNumber: C17901
R39 = 0603 33KΩ (3302) 1%: 贴片电阻; ComponentLink1Description: 供应商链接; ComponentLink1URL: http://www.szlcsc.com/product/details_4623.html; Package: 0603; Supplier: LC; SuppliersPartNumber: C4216
U6 = MP2307: DC-DC降压芯片

## Nets that join several sheets
GND: socket (17 pins), mcu (46 pins), power (25 pins)
VCC3V3: mcu (34 pins), power (C28.1 C29.2 U7.5)
VCC5V: socket (17 pins), mcu (D7.2 R10.1), power (7 pins)
MPU_SCL: socket (P9.3), mcu (R15.2 U3.92 U5.23)
MPU_SDA: socket (P9.4), mcu (R17.2 U3.93 U5.24)
PA0: socket (P5.3), mcu (U3.23)
PA1: socket (P11.3), mcu (U3.24)
PA2: socket (P16.3), mcu (U3.25)
PA3: socket (P17.3), mcu (U3.26)
PA4: socket (P20.5), mcu (U3.29)
PA5: socket (P20.8), mcu (U3.30)
PA6: socket (P20.7), mcu (U3.31)
PA7: socket (P20.6), mcu (U3.32)
PA8: socket (P15.8), mcu (U3.67)
PA9: socket (P18.4), mcu (U3.68)
PA10: socket (P18.3), mcu (U3.69)
PA15: socket (P15.7), mcu (U3.77)
PB0: mcu (U3.35), power (R32.2 U8.1)
PB1: mcu (U3.36), power (C36.1 R39.1 R40.2)
PB8: socket (P10.7), mcu (U3.95)
PB9: socket (P10.8), mcu (U3.96)
PB10: socket (P7.3), mcu (U3.47)
PB11: socket (P13.3), mcu (U3.48)
PC0: socket (P10.1), mcu (U3.15)
PC1: socket (P10.2), mcu (U3.16)
PC2: socket (P10.3), mcu (U3.17)
PC3: socket (P10.4), mcu (U3.18)
PC4: socket (P10.5), mcu (U3.33)
PC5: socket (P10.6), mcu (U3.34)
PC6: socket (P20.4), mcu (U3.63)
PC7: socket (P20.3), mcu (U3.64)
PD0: socket (P15.6), mcu (U3.81)
PD5: socket (P19.4), mcu (U3.86)
PD6: socket (P19.3), mcu (U3.87)
PD8: socket (P21.4), mcu (U3.55)
PD9: socket (P21.3), mcu (U3.56)
PD10: socket (P15.2), mcu (U3.57)
PD11: socket (P15.3), mcu (U3.58)
PD12: socket (P6.3), mcu (U3.59)
PD13: socket (P12.3), mcu (U3.60)
PD14: socket (P15.4), mcu (U3.61)
PD15: socket (P15.5), mcu (U3.62)
PE9: socket (P8.4), mcu (U3.40)
PE10: socket (P8.3), mcu (U3.41)
PE11: socket (P14.4), mcu (U3.42)
PE12: socket (P8.2), mcu (U3.43)
PE13: socket (P14.3), mcu (U3.44)
PE14: socket (P14.2), mcu (U3.45)
PE15: socket (P15.1), mcu (U3.46)